# EasyEDA Pro project ProProject_2024电赛清单扩展板_Wang01_2024-08-05.epro

# Schematic Schematic1
Create Date: 2024-07-23; Page Name: P1; Project Name: 2024电赛清单扩展板_Wang01; Schematic Name: Schematic1; Update Date: 2024-07-27; Company: 嘉立创EDA; Page Size: A4; Version: V1.0
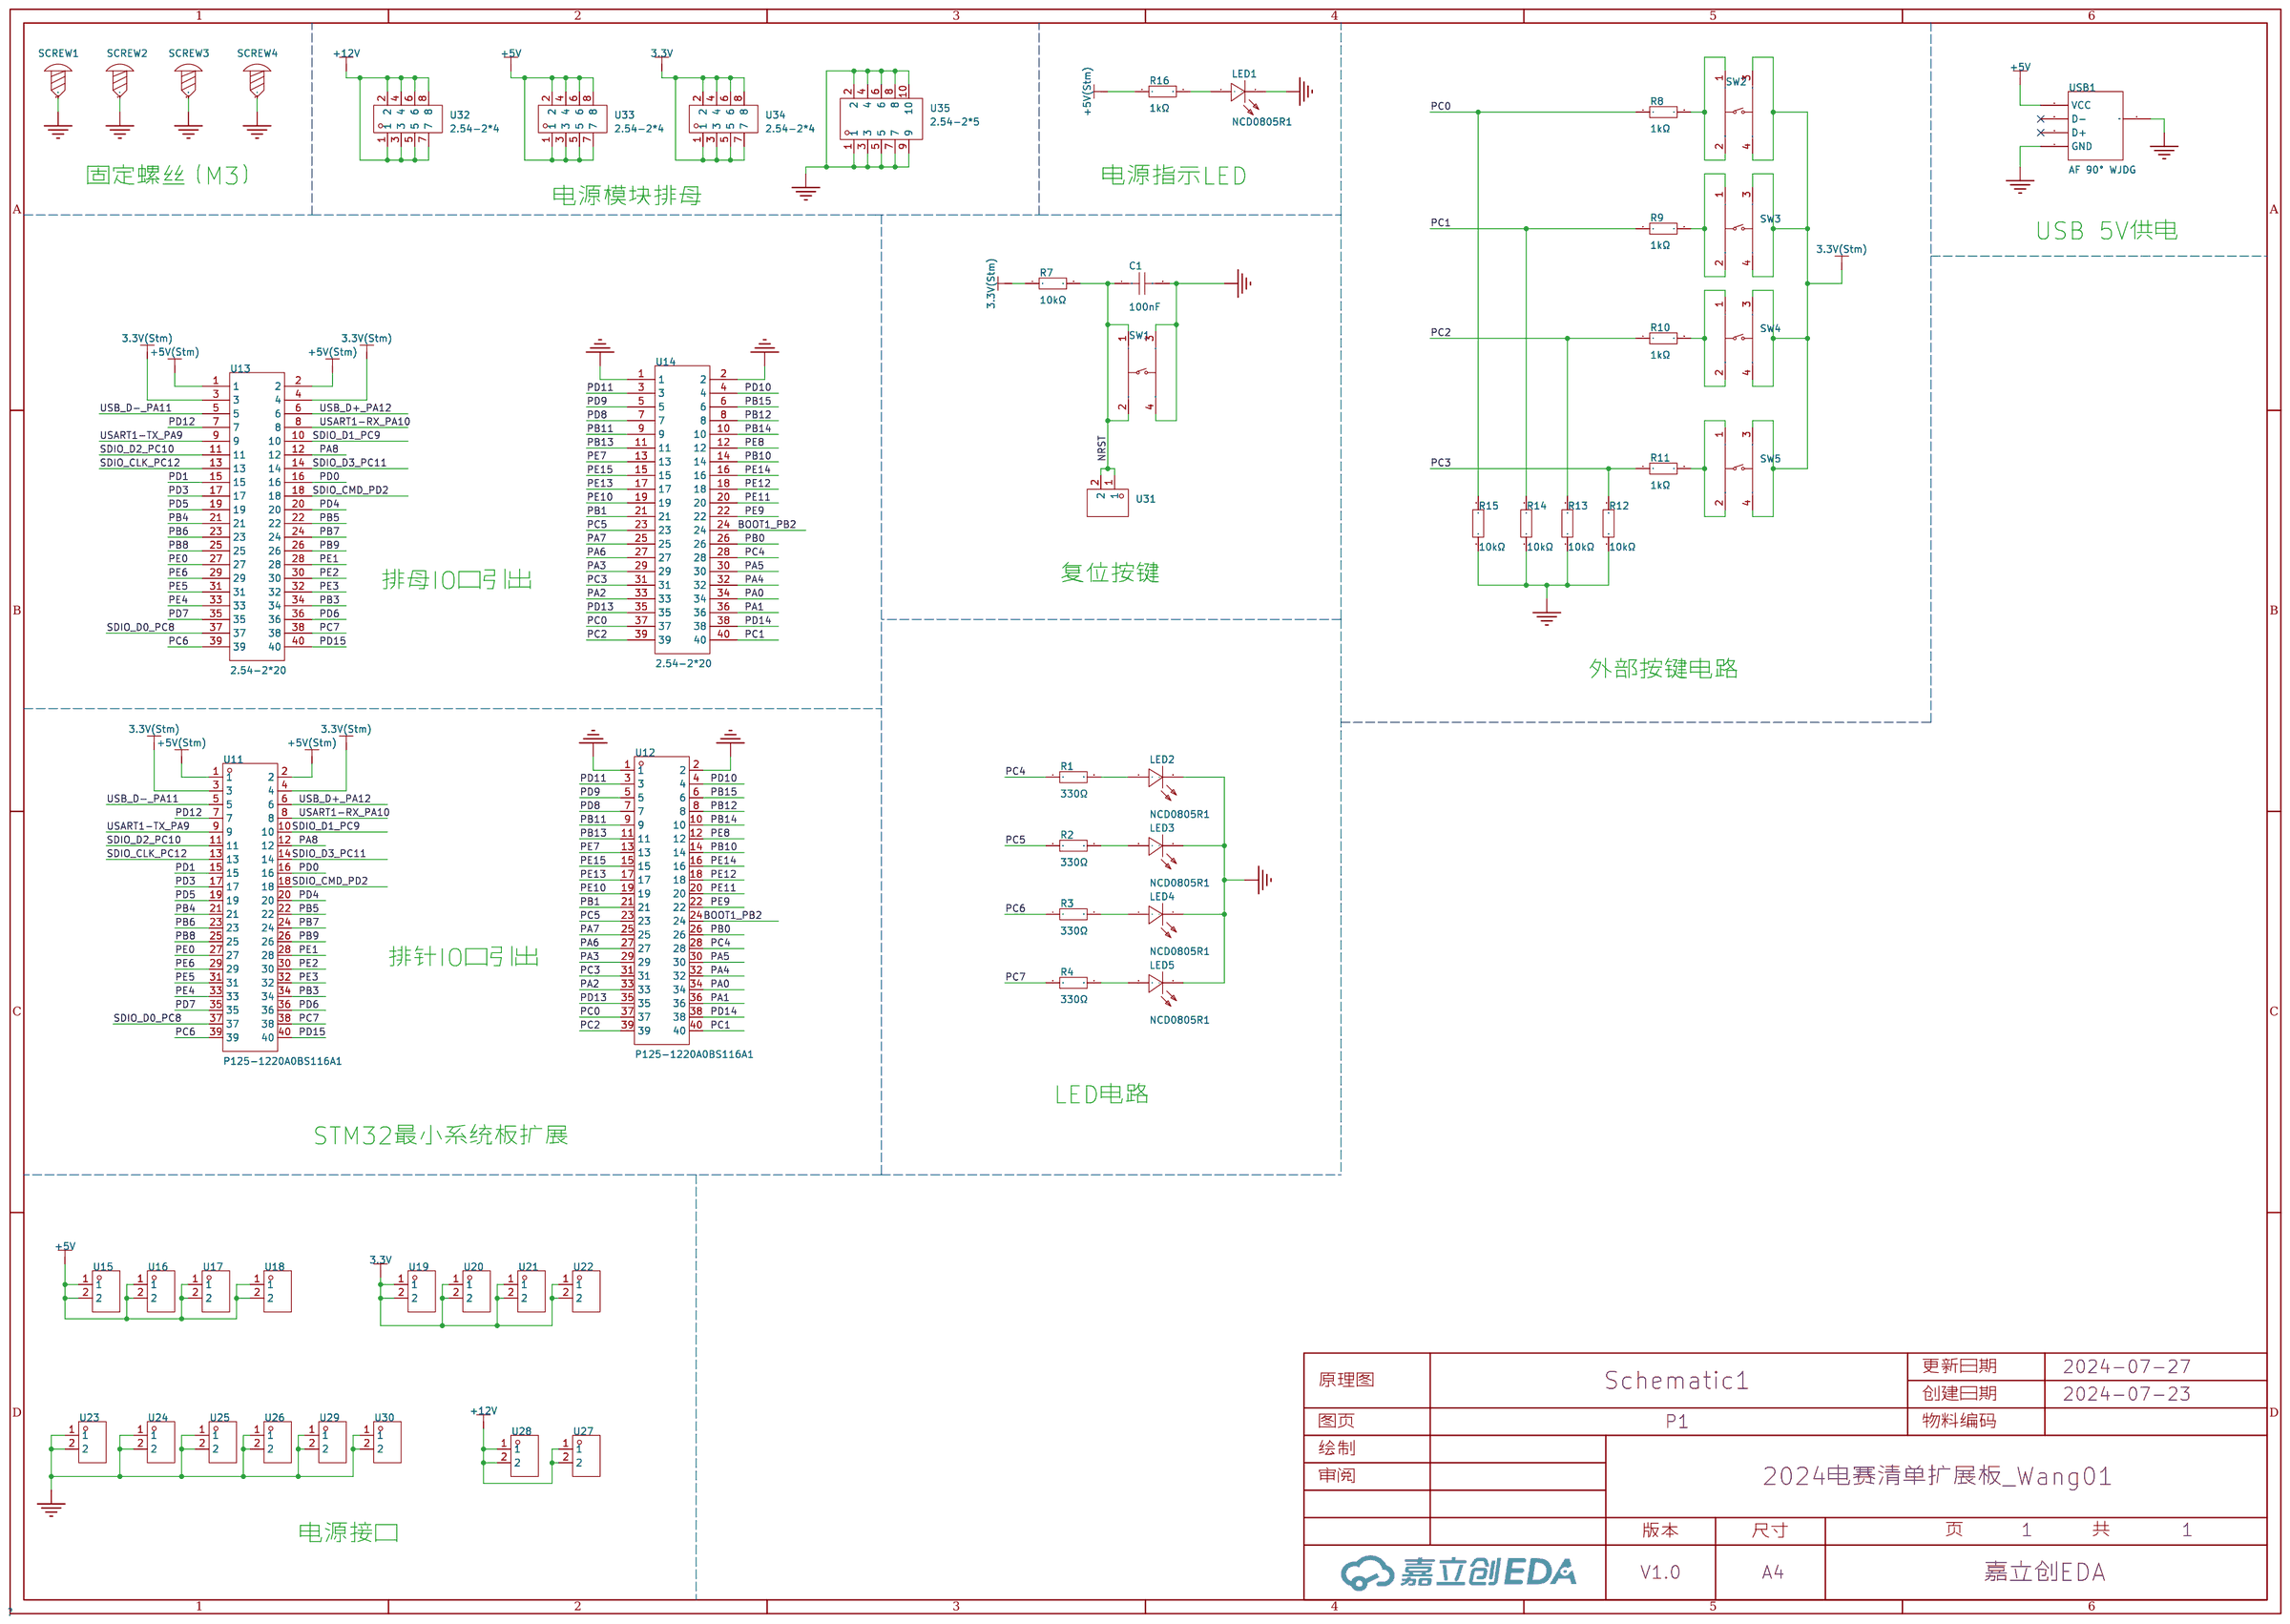
[diagram p0: schematic sheet]

## Parts
C1  100nF  [C0603]
LED1  NCD0805R1  [LED0805-R-RD]
LED2  NCD0805R1  [LED0805-R-RD]
LED3  NCD0805R1  [LED0805-R-RD]
LED4  NCD0805R1  [LED0805-R-RD]
LED5  NCD0805R1  [LED0805-R-RD]
R1  330Ω  [R0805]
R2  330Ω  [R0805]
R3  330Ω  [R0805]
R4  330Ω  [R0805]
R7  10kΩ  [R1206]
R8  1kΩ  [R0805]
R9  1kΩ  [R0805]
R10  1kΩ  [R0805]
R11  1kΩ  [R0805]
R12  10kΩ  [R0805]
R13  10kΩ  [R0805]
R14  10kΩ  [R0805]
R15  10kΩ  [R0805]
R16  1kΩ  [R0603]
SCREW1  -  [M3螺丝]
SCREW2  -  [M3螺丝]
SCREW3  -  [M3螺丝]
SCREW4  -  [M3螺丝]
SW1  TS665CJ  [SW-TH_4P-L6.0-W6.0-P4.50-LS6.5]
SW2  TS665CJ  [SW-TH_4P-L6.0-W6.0-P4.50-LS6.5]
SW3  TS665CJ  [SW-TH_4P-L6.0-W6.0-P4.50-LS6.5]
SW4  TS665CJ  [SW-TH_4P-L6.0-W6.0-P4.50-LS6.5]
SW5  TS665CJ  [SW-TH_4P-L6.0-W6.0-P4.50-LS6.5]
U11  P125-1220A0BS116A1  [HDR-TH_40P-P2.54-V-M-R2-C20-S2.54_10-97-7406]
U12  P125-1220A0BS116A1  [HDR-TH_40P-P2.54-V-M-R2-C20-S2.54_10-97-7406]
U13  2.54-2*20  [HDR-TH_40P-P2.54-V-F-R2-C20-S2.54]
U14  2.54-2*20  [HDR-TH_40P-P2.54-V-F-R2-C20-S2.54]
U15  KF301-5.0-2P  [CONN-TH_P5.00_KF301-5.0-2P]
U16  KF301-5.0-2P  [CONN-TH_P5.00_KF301-5.0-2P]
U17  KF301-5.0-2P  [CONN-TH_P5.00_KF301-5.0-2P]
U18  KF301-5.0-2P  [CONN-TH_P5.00_KF301-5.0-2P]
U19  KF301-5.0-2P  [CONN-TH_P5.00_KF301-5.0-2P]
U20  KF301-5.0-2P  [CONN-TH_P5.00_KF301-5.0-2P]
U21  KF301-5.0-2P  [CONN-TH_P5.00_KF301-5.0-2P]
U22  KF301-5.0-2P  [CONN-TH_P5.00_KF301-5.0-2P]
U23  KF301-5.0-2P  [CONN-TH_P5.00_KF301-5.0-2P]
U24  KF301-5.0-2P  [CONN-TH_P5.00_KF301-5.0-2P]
U25  KF301-5.0-2P  [CONN-TH_P5.00_KF301-5.0-2P]
U26  KF301-5.0-2P  [CONN-TH_P5.00_KF301-5.0-2P]
U27  KF301-5.0-2P  [CONN-TH_P5.00_KF301-5.0-2P]
U28  KF301-5.0-2P  [CONN-TH_P5.00_KF301-5.0-2P]
U29  KF301-5.0-2P  [CONN-TH_P5.00_KF301-5.0-2P]
U30  KF301-5.0-2P  [CONN-TH_P5.00_KF301-5.0-2P]
U31  KF301-5.0-2P  [CONN-TH_P5.00_KF301-5.0-2P]
U32  2.54-2*4  [HDR-TH_8P-P2.54-V-F-R2-C4-S2.54]
U33  2.54-2*4  [HDR-TH_8P-P2.54-V-F-R2-C4-S2.54]
U34  2.54-2*4  [HDR-TH_8P-P2.54-V-F-R2-C4-S2.54]
U35  2.54-2*5  [HDR-TH_10P-P2.54-V-F-R2-C5-S2.54]
USB1  AF 90° WJDG  [USB-A-TH_AF-WJDG]

## Library data of the parts
C1 = CC0603KRX7R9BB104: 容值:100nF;精度:±10%;额定电压:50V;材质(温度系数):X7R;; LCSC Part Name: 100nF ±10% 50V; Supplier Part: C14663; Manufacturer: YAGEO(国巨); Supplier Footprint: 0603; JLCPCB Part Class: 基础库; Datasheet: https://atta.szlcsc.com/upload/public/pdf/source/20180910/C282072_33301C7F631E79921B82A8DAC6BCC5B3.pdf; Supplier: LCSC; Tolerance: ±10%; Voltage Rated: 50V; Temperature Coefficient: X7R
LED1-LED5 = NCD0805R1: 灯头类型:-;发光颜色:红色;正向电压(VF):1.6V~2.6V;功率:65mW;正向电流:20mA;主波长:615nm~630nm;二极管配置:独立二极管;透镜颜色:无色透明透镜;色温:-;发光强度:67mcd~195mcd;发光角度:130°;载带方式:-;工作温度:-30℃~+85℃;; Supplier Part: C84256; Manufacturer: 国星光电; Supplier Footprint: 0805; JLCPCB Part Class: 基础库; Datasheet: https://atta.szlcsc.com/upload/public/pdf/source/20200820/C84256_F0A75A43B3EAD75808600A0514C76B99.pdf; Supplier: LCSC; Emitted Color: 红色; Forward Voltage (VF): 1.6V~2.6V; Power Dissipation: 65mW; Forward Current: 20mA; Dominant Wavelength: 615nm~630nm; Diode Configuration: 独立二极管; Lens Color: 无色透明透镜; Luminous Intensity: 67mcd~195mcd; Viewing Angle: 130°; Operating Temperature: -30℃~+85℃
R1-R4 = 0805W8F3300T5E: 电阻类型:厚膜电阻;阻值:330Ω;精度:±1%;功率:125mW;最大工作电压:150V;温度系数:±100ppm/℃;; LCSC Part Name: 330Ω ±1% 125mW 厚膜电阻; Supplier Part: C17630; Manufacturer: UNI-ROYAL(厚声); Supplier Footprint: 0805; JLCPCB Part Class: 基础库; Datasheet: https://atta.szlcsc.com/upload/public/pdf/source/20200306/C422600_1E6D84923E4A46A82E41ADD87F860B5C.pdf; Supplier: LCSC; Type: 厚膜电阻; Tolerance: ±1%; Power(Watts): 125mW; Overload Voltage (Max): 150V; Temperature Coefficient: ±100ppm/℃; Operating Temperature Range: -55℃~+155℃
R7 = 1206W4F1002T5E: 电阻类型:厚膜电阻;阻值:10kΩ;精度:±1%;功率:250mW;最大工作电压:200V;温度系数:±100ppm/℃;; LCSC Part Name: 10kΩ ±1% 250mW 厚膜电阻; Supplier Part: C17902; Manufacturer: UNI-ROYAL(厚声); Supplier Footprint: 1206; JLCPCB Part Class: 基础库; Datasheet: https://atta.szlcsc.com/upload/public/pdf/source/20200306/C422600_1E6D84923E4A46A82E41ADD87F860B5C.pdf; Supplier: LCSC; Type: 厚膜电阻; Tolerance: ±1%; Power(Watts): 250mW; Overload Voltage (Max): 200V; Temperature Coefficient: ±100ppm/℃; Operating Temperature Range: -55℃~+155℃
R8-R11 = 0805W8F1001T5E: 电阻类型:厚膜电阻;阻值:1kΩ;精度:±1%;功率:125mW;最大工作电压:150V;温度系数:±100ppm/℃;; LCSC Part Name: 1kΩ ±1% 125mW 厚膜电阻; Supplier Part: C17513; Manufacturer: UNI-ROYAL(厚声); Supplier Footprint: 0805; JLCPCB Part Class: 基础库; Datasheet: https://atta.szlcsc.com/upload/public/pdf/source/20200306/C422600_1E6D84923E4A46A82E41ADD87F860B5C.pdf; Supplier: LCSC; Type: 厚膜电阻; Tolerance: ±1%; Power(Watts): 125mW; Overload Voltage (Max): 150V; Temperature Coefficient: ±100ppm/℃; Operating Temperature Range: -55℃~+155℃
R12-R15 = 0805W8F1002T5E_C17414: 电阻类型:厚膜电阻;阻值:10kΩ;精度:±1%;功率:125mW;最大工作电压:150V;温度系数:±100ppm/℃;; LCSC Part Name: 10kΩ ±1% 125mW 厚膜电阻; Supplier Part: C17414; Manufacturer: UNI-ROYAL(厚声); Manufacturer Part: 0805W8F1002T5E; Supplier Footprint: 0805; JLCPCB Part Class: 基础库; Datasheet: https://atta.szlcsc.com/upload/public/pdf/source/20200306/C422600_1E6D84923E4A46A82E41ADD87F860B5C.pdf; Supplier: LCSC; Type: 厚膜电阻; Tolerance: ±1%; Power(Watts): 125mW; Overload Voltage (Max): 150V; Temperature Coefficient: ±100ppm/℃; Operating Temperature Range: -55℃~+155℃
R16 = 0603WAF1001T5E: 电阻类型:厚膜电阻;阻值:1kΩ;精度:±1%;功率:100mW;最大工作电压:75V;温度系数:±100ppm/℃;; LCSC Part Name: 1kΩ ±1% 100mW 厚膜电阻; Supplier Part: C21190; Manufacturer: UNI-ROYAL(厚声); Supplier Footprint: 0603; JLCPCB Part Class: 基础库; Datasheet: https://atta.szlcsc.com/upload/public/pdf/source/20200306/C422600_1E6D84923E4A46A82E41ADD87F860B5C.pdf; Supplier: LCSC; Type: 厚膜电阻; Tolerance: ±1%; Power(Watts): 100mW; Overload Voltage (Max): 75V; Temperature Coefficient: ±100ppm/℃; Operating Temperature Range: -55℃~+155℃
SCREW1-SCREW4 = M3螺丝: Supplier Footprint: 插件
SW1-SW5 = TS665CJ: 电路结构:单刀单掷;按钮形状:圆形按钮;安装方式:直插;开关长度:6mm;开关宽度:6mm;开关高度:5mm;触点电流:50mA;额定电压(DC):12V;带灯:-;机械寿命:-;; LCSC Part Name: 6*6*5mm 直插 轻触开关; Supplier Part: C393938; Manufacturer: SHOU HAN(首韩); Supplier Footprint: 插件; JLCPCB Part Class: 扩展库; Datasheet: https://atta.szlcsc.com/upload/public/pdf/source/20190521/C393938_BDABEAC600B4C55E200A80AA129B70BC.pdf; Supplier: LCSC; Circuit: 单刀单掷; Actuator Style: 圆形按钮; Mounting Style: 直插; Switch Length: 6mm; Switch Width: 6mm; Switch Height: 5mm; Contact Current: 50mA; Voltage Rating (DC): 12V
U11 U12 = P125-1220A0BS116A1: 插针结构:2x20P;间距:2.54mm;行距:2.54mm;圆针/方针:方针;安装类型:直插;排数:双排;总PIN位数:40P;配合针长度:6mm;塑高:2.5mm;端接针长度:3mm;触头材质:黄铜;触头镀层:金;工作温度范围:-40℃~+105℃;颜色:黑色;; LCSC Part Name: 2x20P 间距:2.54mm 方针 直插; Supplier Part: C19190512; Manufacturer: Yxcon(宇熙精密); Supplier Footprint: 插件,P=2.54mm; JLCPCB Part Class: 扩展库; Datasheet: https://atta.szlcsc.com/upload/public/pdf/source/20231110/933F8D648B10E9101EFC894132A28518.pdf; Supplier: LCSC; Pin Structure: 2x20P; Pitch: 2.54mm; Row Spacing: 2.54mm; Circluar Pins/Square Pins: 方针; Mounting Type: 直插; Number of Rows: 双排; Number of Pins: 40P; Length of Mating Pin: 6mm; Insulation Height: 2.5mm; Length of End Connection Pin: 3mm; Contact Material: 黄铜; Contact Plating: 金; Operating Temperature Range: -40℃~+105℃; Color: 黑色
U13 U14 = 2.54-2*20: 插孔结构:2x20P;间距:2.54mm;行距:2.54mm;圆孔/方孔:方孔;安装类型:直插;排数:双排;总孔位数:40P;额定电流:2.5A;额定电压:-;插孔方向:顶部;塑高:8.5mm;工作温度范围:-40℃~+105℃;; LCSC Part Name: 间距:2.54mm 2x20P 直插; Supplier Part: C2977589; Manufacturer: ZHOURI(洲日); Supplier Footprint: 插件,P=2.54mm; JLCPCB Part Class: 扩展库; Datasheet: https://atta.szlcsc.com/upload/public/pdf/source/20220328/834E302BE3C038BBC5C70F5E02589B1E.pdf; Supplier: LCSC; Holes Structure: 2x20P; Pitch: 2.54mm; Row Spacing: 2.54mm; Circular Hole / Square Hole: 方孔; Mounting Type: 直插; Number of Rows: 双排; Number of Holes: 40P; Current Rating (Max): 2.5A; Holes Direction: 顶部; Insulation Height: 8.5mm; Operating Temperature Range: -40℃~+105℃
U15-U31 = KF301-5.0-2P: 结构:1x2P;间距:5mm;颜色:蓝色;安装方式:直插;额定电流:17A;额定电压:250V;排数:1;线规 - AWG:14~22;线规 - 平方毫米:1.5;每排PIN数:2;工作温度范围:-30℃~+120℃;; LCSC Part Name: 5mm 1x2P 排数:1 每排P数:2 直插; Supplier Part: C474881; Manufacturer: KEFA(科发); Supplier Footprint: 插件,P=5mm; JLCPCB Part Class: 扩展库; Datasheet: https://atta.szlcsc.com/upload/public/pdf/source/20230317/03A5B5FC229D6F9225E8F51DA1A4E80A.pdf; Supplier: LCSC; Structure: 1x2P; Pitch: 5mm; Color: 蓝色; Mounting Style: 直插; Current Rating (Max): 17A; Voltage Rating (Max): 250V; Number of Pins: 2P; Number of Rows: 1; Wire Gauge - AWG: 14~22; Wire Gauge - mm2: 1.5; Number of PINs Per Row: 2; Operating Temperature Range: -30℃~+120℃
U32-U34 = 2.54-2*4: 插孔结构:2x4P;间距:2.54mm;行距:2.54mm;圆孔/方孔:方孔;安装类型:直插;排数:双排;总孔位数:8P;额定电流:2.5A;额定电压:-;插孔方向:顶部;塑高:8.5mm;工作温度范围:-40℃~+105℃;; LCSC Part Name: 间距:2.54mm 2x4P 直插; Supplier Part: C2977588; Manufacturer: ZHOURI(洲日); Supplier Footprint: 插件,P=2.54mm; JLCPCB Part Class: 扩展库; Datasheet: https://atta.szlcsc.com/upload/public/pdf/source/20220328/363EB391BC0EB759CF231FC910753CBE.pdf; Supplier: LCSC; Holes Structure: 2x4P; Pitch: 2.54mm; Row Spacing: 2.54mm; Circular Hole / Square Hole: 方孔; Mounting Type: 直插; Number of Rows: 双排; Number of Holes: 8P; Current Rating (Max): 2.5A; Holes Direction: 顶部; Insulation Height: 8.5mm; Operating Temperature Range: -40℃~+105℃
U35 = 2.54-2*5: 插孔结构:2x5P;间距:2.54mm;行距:2.54mm;圆孔/方孔:方孔;安装类型:直插;排数:双排;总孔位数:10P;额定电流:2.5A;额定电压:-;插孔方向:顶部;塑高:8.5mm;工作温度范围:-40℃~+105℃;; LCSC Part Name: 间距:2.54mm 2x5P 直插; Supplier Part: C2977587; Manufacturer: ZHOURI(洲日); Supplier Footprint: 插件,P=2.54mm; JLCPCB Part Class: 扩展库; Datasheet: https://atta.szlcsc.com/upload/public/pdf/source/20220328/53961E697C4FF664B69BABFADEC8B830.pdf; Supplier: LCSC; Holes Structure: 2x5P; Pitch: 2.54mm; Row Spacing: 2.54mm; Circular Hole / Square Hole: 方孔; Mounting Type: 直插; Number of Rows: 双排; Number of Holes: 10P; Current Rating (Max): 2.5A; Holes Direction: 顶部; Insulation Height: 8.5mm; Operating Temperature Range: -40℃~+105℃
USB1 = AF 90° WJDG: 连接器类型:Type-A;标准:USB 2.0;公母:母;端口数量:1;触点数量:4P;安装方式:弯插;额定电流 - 电源:1.5A;工作温度范围:-25℃~+85℃;; LCSC Part Name: Type-A 母 弯插; Supplier Part: C456018; Manufacturer: SHOU HAN(首韩); Supplier Footprint: 插件; JLCPCB Part Class: 扩展库; Datasheet: https://atta.szlcsc.com/upload/public/pdf/source/20191113/C456018_B104E062BEB8E11E57E63560E04EE13A.pdf; Supplier: LCSC; Connector Type: Type-A; Standard: USB 2.0; Gender: 母; Number of Ports: 1; Number of Contacts: 4P; Mounting Style: 弯插; Current Rating - Power (Max): 1.5A; Operating Temperature Range: -25℃~+85℃

## Nets
3.3V: U19.1 U19.2 U20.1 U20.2 U21.1 U21.2 U22.1 U22.2 U34.1 U34.2 U34.3 U34.4 U34.5 U34.6 U34.7 U34.8
3.3V(Stm): R7.1 SW2.3(C) SW2.4(D) SW3.3(C) SW3.4(D) SW4.3(C) SW4.4(D) SW5.3(C) SW5.4(D) U11.3 U11.4 U13.3 U13.4
+5V: U15.1 U15.2 U16.1 U16.2 U17.1 U17.2 U18.1 U18.2 U33.1 U33.2 U33.3 U33.4 U33.5 U33.6 U33.7 U33.8 USB1.1(VCC)
+5V(Stm): R16.1 U11.1 U11.2 U13.1 U13.2
+12V: U27.1 U27.2 U28.1 U28.2 U32.1 U32.2 U32.3 U32.4 U32.5 U32.6 U32.7 U32.8
GND: C1.2 LED1.2(-) LED2.2(-) LED3.2(-) LED4.2(-) LED5.2(-) R12.1 R13.1 R14.1 R15.1 SCREW1.1 SCREW2.1 SCREW3.1 SCREW4.1 SW1.3(C) SW1.4(D) U12.1 U12.2 U14.1 U14.2 U23.1 U23.2 U24.1 U24.2 U25.1 U25.2 U26.1 U26.2 U29.1 U29.2 U30.1 U30.2 U35.1 U35.2 U35.3 U35.4 U35.5 U35.6 U35.7 U35.8 U35.9 U35.10 USB1.4(GND) USB1.5(SHLD)
BOOT1_PB2: U12.24 U14.24
NRST: C1.1 R7.2 SW1.1(A) SW1.2(B) U31.1 U31.2
PA0: U12.34 U14.34
PA1: U12.36 U14.36
PA2: U12.33 U14.33
PA3: U12.29 U14.29
PA4: U12.32 U14.32
PA5: U12.30 U14.30
PA6: U12.27 U14.27
PA7: U12.25 U14.25
PA8: U11.12 U13.12
PB0: U12.26 U14.26
PB1: U12.21 U14.21
PB3: U11.34 U13.34
PB4: U11.21 U13.21
PB5: U11.22 U13.22
PB6: U11.23 U13.23
PB7: U11.24 U13.24
PB8: U11.25 U13.25
PB9: U11.26 U13.26
PB10: U12.14 U14.14
PB11: U12.9 U14.9
PB12: U12.8 U14.8
PB13: U12.11 U14.11
PB14: U12.10 U14.10
PB15: U12.6 U14.6
PC0: R8.1 R15.2 U12.37 U14.37
PC1: R9.1 R14.2 U12.40 U14.40
PC2: R10.1 R13.2 U12.39 U14.39
PC3: R11.1 R12.2 U12.31 U14.31
PC4: R1.1 U12.28 U14.28
PC5: R2.1 U12.23 U14.23
PC6: R3.1 U11.39 U13.39
PC7: R4.1 U11.38 U13.38
PD0: U11.16 U13.16
PD1: U11.15 U13.15
PD3: U11.17 U13.17
PD4: U11.20 U13.20
PD5: U11.19 U13.19
PD6: U11.36 U13.36
PD7: U11.35 U13.35
PD8: U12.7 U14.7
PD9: U12.5 U14.5
PD10: U12.4 U14.4
PD11: U12.3 U14.3
PD12: U11.7 U13.7
PD13: U12.35 U14.35
PD14: U12.38 U14.38
PD15: U11.40 U13.40
PE0: U11.27 U13.27
PE1: U11.28 U13.28
PE2: U11.30 U13.30
PE3: U11.32 U13.32
PE4: U11.33 U13.33
PE5: U11.31 U13.31
PE6: U11.29 U13.29
PE7: U12.13 U14.13
PE8: U12.12 U14.12
PE9: U12.22 U14.22
PE10: U12.19 U14.19
PE11: U12.20 U14.20
PE12: U12.18 U14.18
PE13: U12.17 U14.17
PE14: U12.16 U14.16
PE15: U12.15 U14.15
SDIO_CLK_PC12: U11.13 U13.13
SDIO_CMD_PD2: U11.18 U13.18
SDIO_D0_PC8: U11.37 U13.37
SDIO_D1_PC9: U11.10 U13.10
SDIO_D2_PC10: U11.11 U13.11
SDIO_D3_PC11: U11.14 U13.14
USART1-RX_PA10: U11.8 U13.8
USART1-TX_PA9: U11.9 U13.9
USB_D+_PA12: U11.6 U13.6
USB_D-_PA11: U11.5 U13.5
$LED2_1: LED2.1(+) R1.2
$LED3_1: LED3.1(+) R2.2
$LED4_1: LED4.1(+) R3.2
$LED5_1: LED5.1(+) R4.2
Net-(LED1-1): LED1.1(+) R16.2
Net-(R8-2): R8.2 SW2.1(A) SW2.2(B)
Net-(R9-2): R9.2 SW3.1(A) SW3.2(B)
Net-(R10-2): R10.2 SW4.1(A) SW4.2(B)
Net-(R11-2): R11.2 SW5.1(A) SW5.2(B)

Not connected (* = marked no-connect by the designer): USB1 2(D-)* 3(D+)*

## Notes on the sheet
- 固定螺丝（M3）
- 电源指示LED
- 电源模块排母
- USB 5V供电
- 排母IO口引出
- 复位按键
- 外部按键电路
- 排针IO口引出
- LED电路
- STM32最小系统板扩展
- 电源接口

# Board PCB1
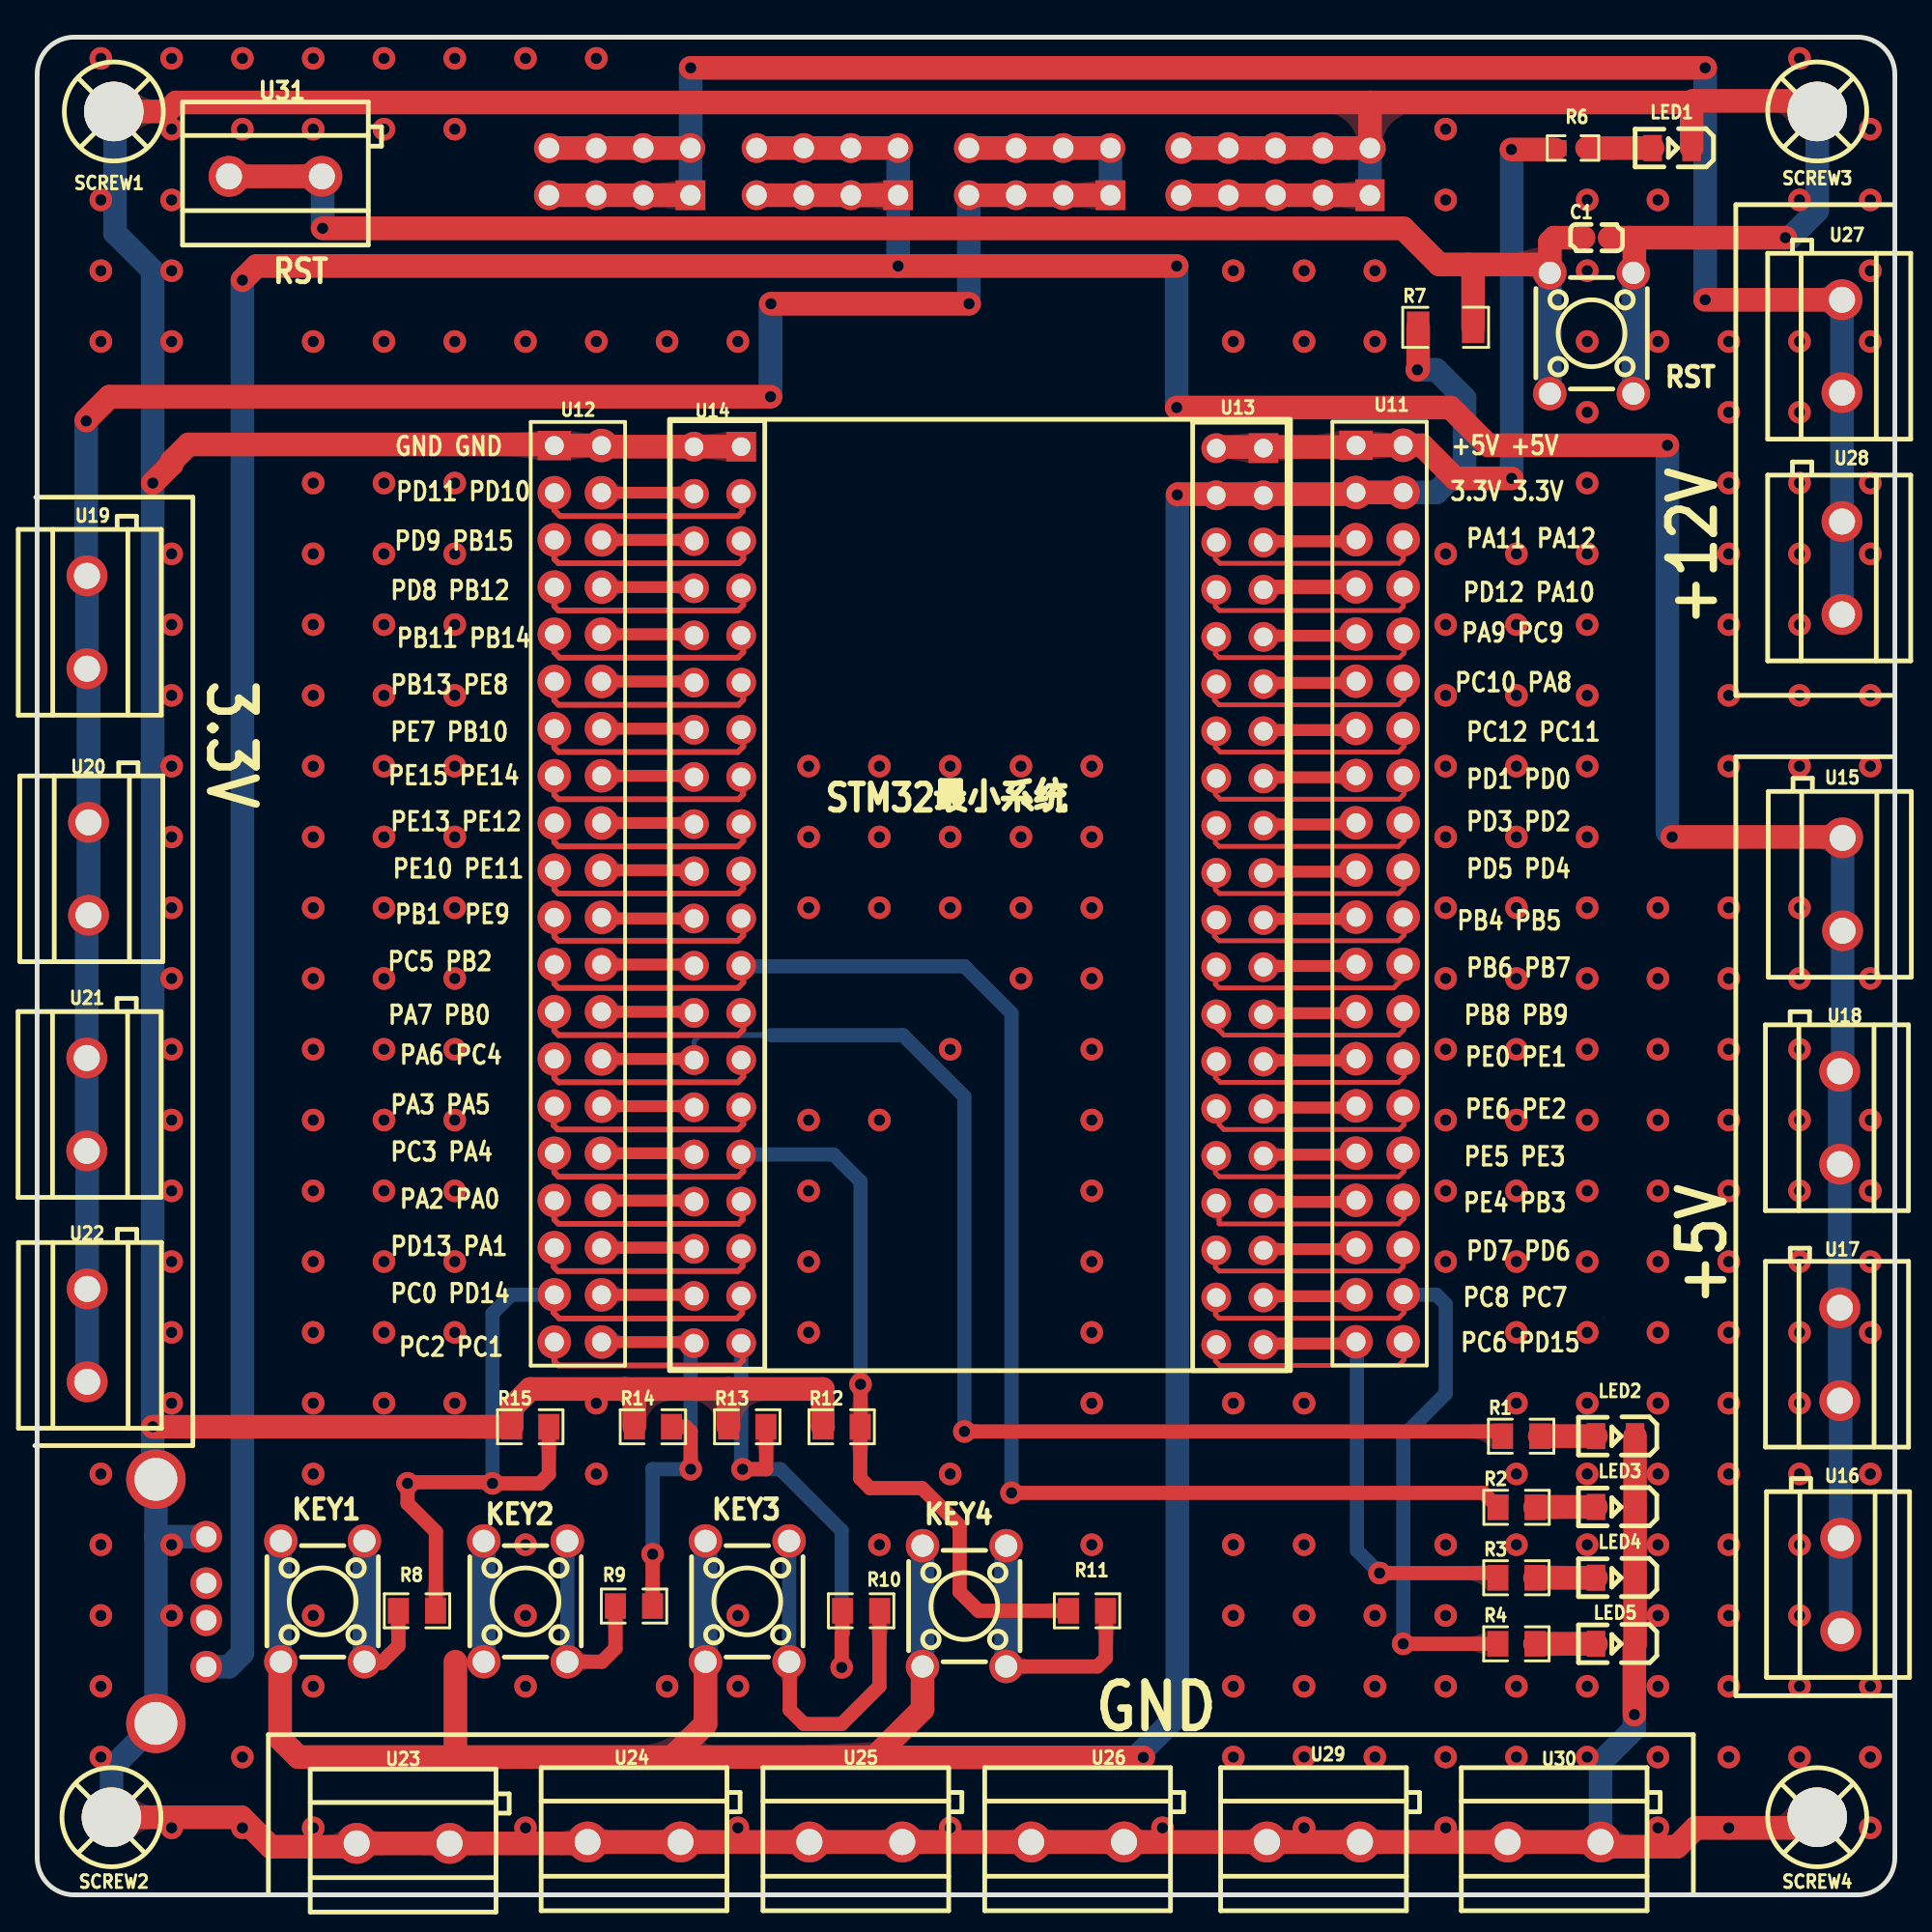
[diagram p1: board, top side]
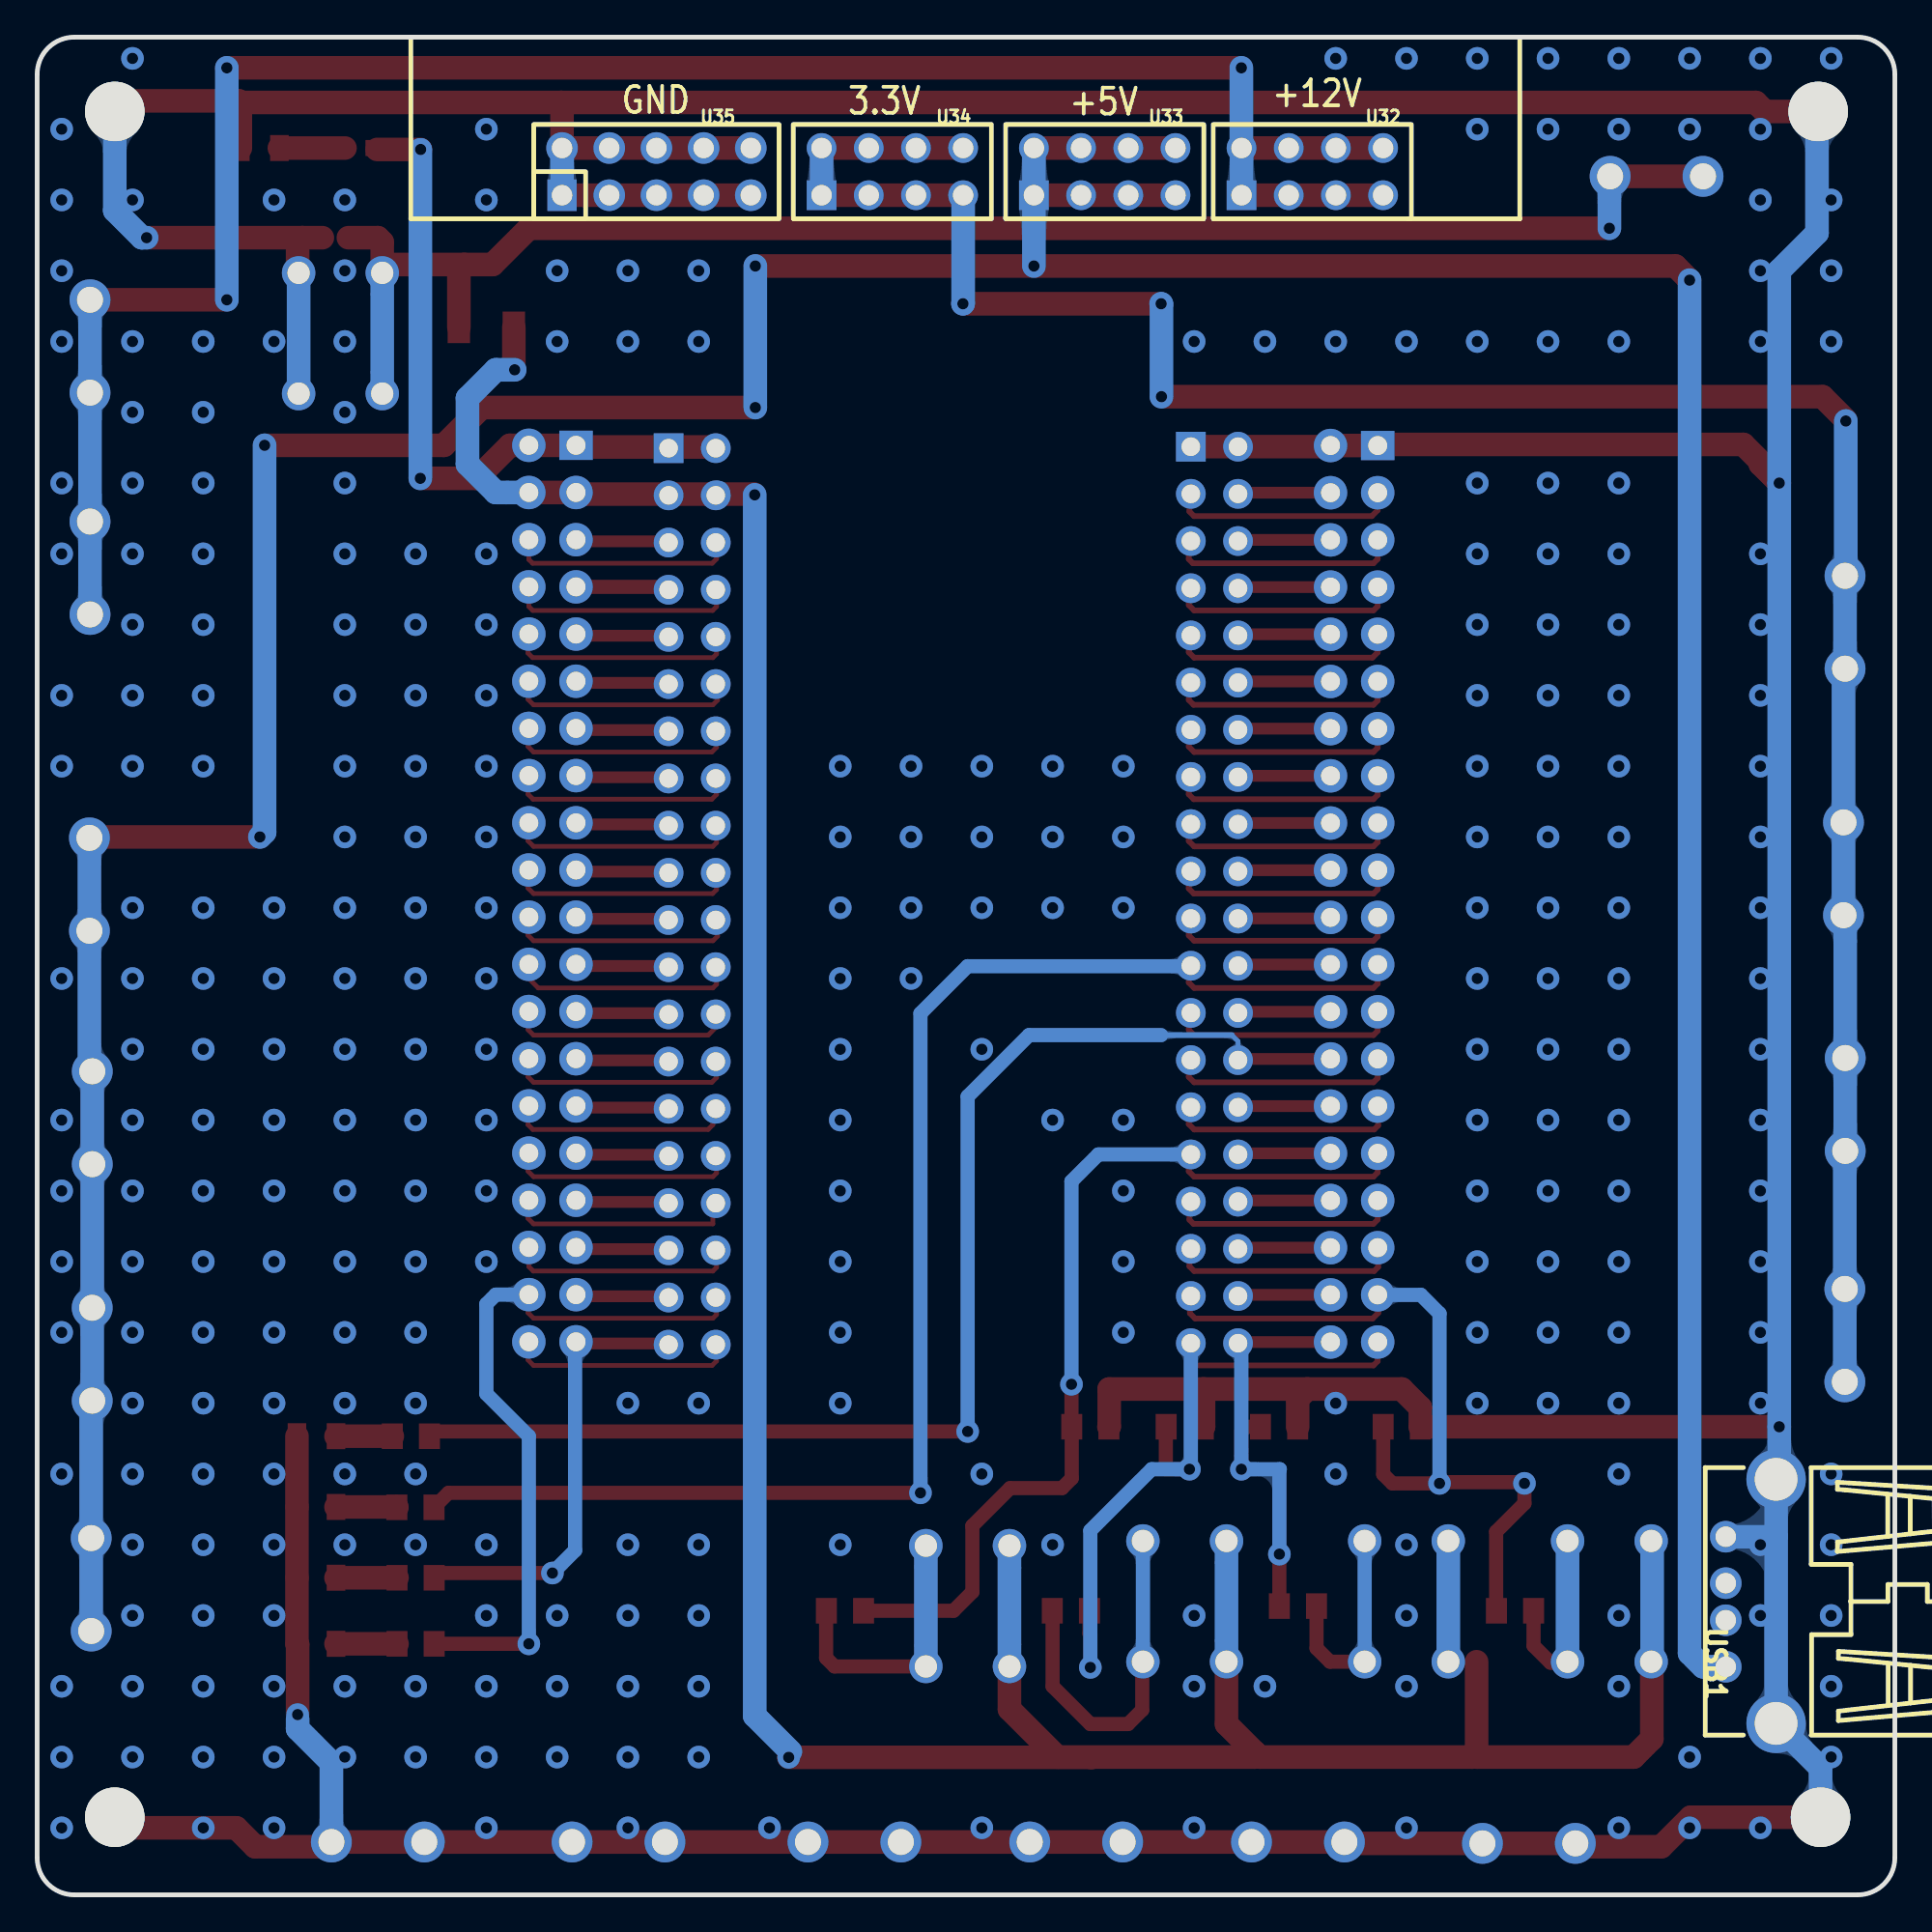
[diagram p2: board, bottom side, seen from below]

Outline 100 x 100 mm; copper layers: Top Layer, Bottom Layer. Coordinates in mm from the lower left corner of the outline.
Outline path: 0,98 0,2 arc(0.59,0.59) 2,0 98,0 arc(99.41,0.59) 100,2 100,98 arc(99.41,99.41) 98,100 2,100 arc(0.59,99.41) 0,98
Stack: Top Layer 0.035mm / Dielectric1 1.51mm FR4 er 4.5 / Bottom Layer 0.035mm

## Design rules (mm)
template: 自定义配置
spacing copperThickness1oz (default): track to track 0.102, other pairs 0.152 to 0.3
spacing copperThickness2oz: track to track 0.203, other pairs 0.152 to 0.3
track width copperThickness1oz (default): min 0.254, default 0.762, max 2.54
track width copperThickness2oz: min 0.203, default 0.254, max 2.54
track width 12V: min 0.762, default 1.27, max 2.54
track width 5V: min 0.762, default 1.27, max 2.54
track width 3.3V: min 0.762, default 1.27, max 2.54
track width GND: min 0.762, default 1.27, max 2.54
differential pair differentialPair (default): width min 0.127, default 0.254, max 2.54; gap min 0.152, default 0.152
via viaSize: diameter min 0.5, default 0.61, max 10; hole min 0.3, default 0.305, max 6.299
via BIG (default): diameter min 1.219, default 1.524, max 10; hole min 0.61, default 0.762, max 6.299
net 3.3V uses 3.3V
net +5V uses 5V
net GND uses GND
net +12V uses 12V

## Placement (name value [footprint] x y rotation side)
C1  100nF  [C0603]  83.95 89.2 0 top
KEY1  TS665CJ  [sw-th_4p-l6.0-w6.0-p4.50-ls6.5#2]  15.37 15.8 270 top
KEY2  TS665CJ  [sw-th_4p-l6.0-w6.0-p4.50-ls6.5#2]  26.29 15.8 270 top
KEY3  TS665CJ  [sw-th_4p-l6.0-w6.0-p4.50-ls6.5#2]  38.23 15.8 270 top
KEY4  TS665CJ  [SW-TH_4P-L6.0-W6.0-P4.50-LS6.5]  49.91 15.55 270 top
LED1  NCD0805R1  [LED0805-R-RD]  88.01 94.03 180 top
LED2  NCD0805R1  [LED0805-R-RD]  84.96 24.69 180 top
LED3  NCD0805R1  [LED0805-R-RD]  84.96 20.88 180 top
LED4  NCD0805R1  [LED0805-R-RD]  84.96 17.07 180 top
LED5  NCD0805R1  [LED0805-R-RD]  84.96 13.51 180 top
R1  330Ω  [R0805]  79.88 24.69 0 top
R2  330Ω  [R0805]  79.64 20.86 0 top
R3  330Ω  [R0805]  79.63 17.07 0 top
R4  330Ω  [R0805]  79.63 13.51 0 top
R6  510Ω  [R0603]  82.68 94.03 0 top
R7  10kΩ  [R1206]  75.82 84.38 0 top
R8  1kΩ  [R0805]  20.45 15.29 180 top
R9  1kΩ  [R0805]  32.13 15.55 180 top
R10  1kΩ  [R0805]  44.35 15.29 0 top
R11  1kΩ  [R0805]  56.51 15.29 0 top
R12  10kΩ  [R0805]  43.31 25.2 0 top
R13  10kΩ  [R0805]  38.23 25.2 0 top
R14  10kΩ  [R0805]  33.15 25.2 0 top
R15  10kΩ  [R0805]  26.54 25.2 0 top
RST  TS665CJ  [sw-th_4p-l6.0-w6.0-p4.50-ls6.5]  83.67 84.06 90 top
SCREW1  -  [M3螺丝]  4.19 95.94 0 top
SCREW2  -  [M3螺丝]  4.06 4.12 0 top
SCREW3  -  [M3螺丝]  95.88 95.94 0 top
SCREW4  -  [M3螺丝]  95.88 4.12 0 top
U11  P125-1220A0BS116A1  [hdr-th_40p-p2.54-v-m-r2-c20-s2.54_10-97-7406]  72.26 53.9 270 top
U12  P125-1220A0BS116A1  [hdr-th_40p-p2.54-v-m-r2-c20-s2.54_10-97-7406]  29.11 53.89 270 top
U13  2.54-2*20  [hdr-th_40p-p2.54-v-f-r2-c20-s2.54]  64.74 53.75 90 top
U14  2.54-2*20  [hdr-th_40p-p2.54-v-f-r2-c20-s2.54]  36.63 53.83 90 top
U15  KF301-5.0-2P  [conn-th_p5.00_kf301-5.0-2p#2]  97.19 54.4 90 top
U16  KF301-5.0-2P  [conn-th_p5.00_kf301-5.0-2p#2]  97.09 16.7 90 top
U17  KF301-5.0-2P  [conn-th_p5.00_kf301-5.0-2p#2]  97.04 29.1 90 top
U18  KF301-5.0-2P  [conn-th_p5.00_kf301-5.0-2p#2]  97.03 41.83 90 top
U19  KF301-5.0-2P  [conn-th_p5.00_kf301-5.0-2p]  2.68 68.5 270 top
U20  KF301-5.0-2P  [conn-th_p5.00_kf301-5.0-2p]  2.77 55.23 270 top
U21  KF301-5.0-2P  [conn-th_p5.00_kf301-5.0-2p]  2.67 42.55 270 top
U22  KF301-5.0-2P  [conn-th_p5.00_kf301-5.0-2p]  2.69 30.12 270 top
U23  KF301-5.0-2P  [CONN-TH_P5.00_KF301-5.0-2P]  19.7 2.77 0 top
U24  KF301-5.0-2P  [CONN-TH_P5.00_KF301-5.0-2P]  32.13 2.84 0 top
U25  KF301-5.0-2P  [CONN-TH_P5.00_KF301-5.0-2P]  44.07 2.84 0 top
U26  KF301-5.0-2P  [CONN-TH_P5.00_KF301-5.0-2P]  56.01 2.84 0 top
U27  KF301-5.0-2P  [conn-th_p5.00_kf301-5.0-2p#2]  97.16 83.36 90 top
U28  KF301-5.0-2P  [conn-th_p5.00_kf301-5.0-2p#2]  97.16 71.42 90 top
U29  KF301-5.0-2P  [CONN-TH_P5.00_KF301-5.0-2P]  68.71 2.84 0 top
U30  KF301-5.0-2P  [CONN-TH_P5.00_KF301-5.0-2P]  81.66 2.84 0 top
U31  KF301-5.0-2P  [CONN-TH_P5.00_KF301-5.0-2P]  12.83 92.51 0 top
U32  2.54-2*4  [HDR-TH_8P-P2.54-V-F-R2-C4-S2.54]  31.36 92.76 180 bottom
U33  2.54-2*4  [HDR-TH_8P-P2.54-V-F-R2-C4-S2.54]  42.53 92.76 180 bottom
U34  2.54-2*4  [HDR-TH_8P-P2.54-V-F-R2-C4-S2.54]  53.96 92.76 180 bottom
U35  2.54-2*5  [HDR-TH_10P-P2.54-V-F-R2-C5-S2.54]  66.66 92.76 180 bottom
USB1  AF 90° WJDG  [USB-A-TH_AF-WJDG]  7.75 15.8 90 bottom

## Footprints (pads in the part's own frame, mm; a bottom-side part is the same pattern mirrored in y, then rotated)
C0603
  rect 0.8x0.9 smd: 1(-0.7,0) 2(0.7,0)
CONN-TH_P5.00_KF301-5.0-2P
  round 2.2 hole 1.4: 1(-2.5,0) 2(2.5,0)
conn-th_p5.00_kf301-5.0-2p
  round 2.2 hole 1.4: 1(2.5,0) 2(-2.5,0)
conn-th_p5.00_kf301-5.0-2p#2
  round 2.2 hole 1.4: 1(-2.5,0) 2(2.5,0)
HDR-TH_8P-P2.54-V-F-R2-C4-S2.54
  rect 1.6x1.6 hole 1.1: 1(-3.81,-1.27)
  round 1.6 hole 1.1: 2(-3.81,1.27) 3(-1.27,-1.27) 4(-1.27,1.27) 5(1.27,-1.27) 6(1.27,1.27) 7(3.81,-1.27) 8(3.81,1.27)
HDR-TH_10P-P2.54-V-F-R2-C5-S2.54
  rect 1.575x1.7 hole 1.1: 1(-5.08,-1.27)
  round 1.7 hole 1.1: 2(-5.08,1.27) 3(-2.54,-1.27) 4(-2.54,1.27) 5(0,-1.27) 6(0,1.27) 7(2.54,-1.27) 8(2.54,1.27) 9(5.08,-1.27) 10(5.08,1.27)
hdr-th_40p-p2.54-v-f-r2-c20-s2.54
  rect 1.6x1.6 hole 1: 1(24.13,-1.27)
  round 1.6 hole 1: 2(24.13,1.27) 3(21.59,-1.27) 4(21.59,1.27) 5(19.05,-1.27) 6(19.05,1.27) 7(16.51,-1.27) 8(16.51,1.27) 9(13.97,-1.27) 10(13.97,1.27) 11(11.43,-1.27) 12(11.43,1.27) 13(8.89,-1.27) 14(8.89,1.27) 15(6.35,-1.27) 16(6.35,1.27) 17(3.81,-1.27) 18(3.81,1.27) 19(1.27,-1.27) 20(1.27,1.27) 21(-1.27,-1.27) 22(-1.27,1.27) 23(-3.81,-1.27) 24(-3.81,1.27) 25(-6.35,-1.27) 26(-6.35,1.27) 27(-8.89,-1.27) 28(-8.89,1.27) 29(-11.43,-1.27) 30(-11.43,1.27) 31(-13.97,-1.27) 32(-13.97,1.27) 33(-16.51,-1.27) 34(-16.51,1.27) 35(-19.05,-1.27) 36(-19.05,1.27) 37(-21.59,-1.27) 38(-21.59,1.27) 39(-24.13,-1.27) 40(-24.13,1.27)
hdr-th_40p-p2.54-v-m-r2-c20-s2.54_10-97-7406
  rect 1.575x1.8 hole 1.02: 1(-24.13,-1.27)
  round 1.8 hole 1.02: 2(-24.13,1.27) 3(-21.59,-1.27) 4(-21.59,1.27) 5(-19.05,-1.27) 6(-19.05,1.27) 7(-16.51,-1.27) 8(-16.51,1.27) 9(-13.97,-1.27) 10(-13.97,1.27) 11(-11.43,-1.27) 12(-11.43,1.27) 13(-8.89,-1.27) 14(-8.89,1.27) 15(-6.35,-1.27) 16(-6.35,1.27) 17(-3.81,-1.27) 18(-3.81,1.27) 19(-1.27,-1.27) 20(-1.27,1.27) 21(1.27,-1.27) 22(1.27,1.27) 23(3.81,-1.27) 24(3.81,1.27) 25(6.35,-1.27) 26(6.35,1.27) 27(8.89,-1.27) 28(8.89,1.27) 29(11.43,-1.27) 30(11.43,1.27) 31(13.97,-1.27) 32(13.97,1.27) 33(16.51,-1.27) 34(16.51,1.27) 35(19.05,-1.27) 36(19.05,1.27) 37(21.59,-1.27) 38(21.59,1.27) 39(24.13,-1.27) 40(24.13,1.27)
LED0805-R-RD
  rect 1x1.399 smd: 1(1.05,0) 2(-1.05,0)
M3螺丝
  round 3.2 hole 3.2: 1(-0.064,0.064)
R0603
  rect 0.806x0.864 smd: 1(-0.753,0) 2(0.753,0)
R0805
  rect 1.133x1.377 smd: 1(-1,0) 2(1,0)
R1206
  rect 1.208x1.701 smd: 1(-1.479,0) 2(1.479,0)
sw-th_4p-l6.0-w6.0-p4.50-ls6.5
  round 1.8 hole 1.2: 1(3.25,2.25) 2(-3.25,2.25) 3(3.25,-2.25) 4(-3.25,-2.25)
SW-TH_4P-L6.0-W6.0-P4.50-LS6.5
  round 1.8 hole 1.2: 1(-3.25,2.25) 2(3.25,2.25) 3(-3.25,-2.25) 4(3.25,-2.25)
sw-th_4p-l6.0-w6.0-p4.50-ls6.5#2
  round 1.8 hole 1.2: 1(-3.25,2.25) 2(3.25,2.25) 3(-3.25,-2.25) 4(3.25,-2.25)
USB-A-TH_AF-WJDG
  round 1.7 hole 1.1: 1(-3.521,1.355) 2(-1.018,1.355) 3(0.981,1.355) 4(3.48,1.355)
  round 3.2 hole 2.3: 5(-6.57,-1.355) 5(6.57,-1.355)

## Nets
As in the schematic, except:
3.3V(STM): KEY1.3 KEY1.4 KEY2.3 KEY2.4 KEY3.3 KEY3.4 KEY4.3 KEY4.4 R7.1 U11.3 U11.4 U13.3 U13.4
+5V(STM): R6.1 U11.1 U11.2 U13.1 U13.2
GND: C1.2 LED1.2 LED2.2 LED3.2 LED4.2 LED5.2 R12.1 R13.1 R14.1 R15.1 RST.3 RST.4 SCREW1.1 SCREW2.1 SCREW3.1 SCREW4.1 U12.1 U12.2 U14.1 U14.2 U23.1 U23.2 U24.1 U24.2 U25.1 U25.2 U26.1 U26.2 U29.1 U29.2 U30.1 U30.2 U35.1 U35.2 U35.3 U35.4 U35.5 U35.6 U35.7 U35.8 U35.9 U35.10 USB1.4 USB1.5
$LED1_1: LED1.1 R6.2
$R8_2: KEY1.1 KEY1.2 R8.2
$R9_2: KEY2.1 KEY2.2 R9.2
$R10_2: KEY3.1 KEY3.2 R10.2
$R11_2: KEY4.1 KEY4.2 R11.2
NRST: C1.1 R7.2 RST.1 RST.2 U31.1 U31.2

Pads without a net: USB1 2 3

## Via types
v1: diameter 1.219, hole 0.61, Top Layer to Bottom Layer, 326 vias

## Routing (per net, layer and track width the routed paths; a pad name or vN(x,y) marks a point on that pad's centre or on a via; arc(x,y) is an arc through that point)
3.3V: length 128.5
  Top Layer w1.27: U34.2 U34.4 U34.6 U34.8 ; 57.77,91.49 50.15,91.49 ; v1(39.48,80.65) 3.9,80.65 2.65,79.4 ; 2.77,70.92 U19.2 ; v1(50.16,85.65) v1(39.5,85.65)
  Bottom Layer w1.27: v1(2.64,79.34) 2.64,71.11 2.67,71.08 ; v1(39.48,80.65) 39.48,85.63 v1(39.5,85.65) ; U19.2 U19.1 2.77,65.92 U20.2 U20.1 2.67,52.64 U21.2 U21.1 2.69,40.02 U22.2 U22.1 ; v1(50.16,85.65) 50.15,85.66 50.15,91.49 ; 57.77,91.49 U34.2
3.3V(STM): length 189.6
  Top Layer w1.27: KEY3.4 35.98,9.19 34.45,7.67 ; 22.52,7.63 22.52,12.55 ; 22.52,7.63 22.73,7.42 34.2,7.42 34.45,7.67 ; 22.52,7.63 22.52,7.42 14.06,7.42 13.08,8.4 13.08,12.55 ; 74.34,84.38 74.34,82.14 v1(74.29,82.09) ; 34.45,7.67 34.45,7.42 45.09,7.42 47.66,9.99 KEY4.4 ; 61.39,75.37 61.41,75.4 70.95,75.4 71.03,75.49 73.57,75.49 ; 43.25,7.39 43.26,7.4 v1(59.54,7.4)
  Bottom Layer w1.27: KEY3.4 KEY3.3 ; v1(74.29,82.09) 75.31,82.09 76.84,80.57 76.84,77.01 75.31,75.49 73.57,75.49 ; KEY2.4 KEY2.3 ; 63.34,75.49 63.43,75.4 ; KEY4.4 KEY4.3 ; v1(61.37,75.36) 61.37,9.64 59.45,7.72 ; 13.07,19.05 13.07,13.01 13.12,12.96 KEY1.4
+5V: length 256.4
  Top Layer w1.27: v1(61.34,87.68) v1(46.34,87.68) 11.81,87.68 v1(11.05,86.92) ; v1(87.76,78.03) 78.1,78.03 76.07,80.06 v1(61.34,80.06) ; U33.2 U33.4 U33.6 U33.8 ; v1(88.01,56.95) 97.14,56.95 U15.2 ; 46.34,91.49 38.72,91.49
  Bottom Layer w1.27: v1(61.34,87.68) v1(61.34,80.06) ; v1(88.01,56.95) 87.76,57.2 v1(87.76,78.03) ; v1(11.05,86.92) 11.05,13 10.32,12.28 USB1.1 ; v1(46.34,87.68) U33.2 ; U15.2 U15.1 97.19,44.49 U18.2 U18.1 97.03,31.61 U17.2 U17.1 97.09,26.55 U16.2 U16.1
+5V(STM): length 36.7
  Top Layer w1.27: v1(79.38,76.25) 76.33,76.25 74.55,78.03 71.03,78.03 70.95,77.94 63.43,77.94 ; v1(79.36,93.95) 81.7,93.95
  Bottom Layer w1.27: v1(79.38,76.25) 79.38,93.93
+12V: length 113.5
  Top Layer w1.27: 27.55,91.49 35.17,91.49 ; U27.2 v1(89.79,85.86) ; U32.2 U32.4 U32.6 U32.8 ; v1(89.79,98.35) v1(35.18,98.35)
  Bottom Layer w1.27: U27.2 U27.1 U28.2 U28.1 ; v1(89.79,98.35) v1(89.79,85.86) ; v1(35.18,98.35) 35.18,94.04 U32.2 35.17,91.49
GND: length 434.4
  Top Layer w1.27: 31.62,27.23 26.54,27.23 25.54,26.23 R15.1 v1(6.22,25.2) ; 31.62,27.23 32.15,26.71 R14.1 ; 31.62,27.23 37.21,27.23 ; 71.78,96.49 7.48,96.49 7,96 SCREW1.1 ; 71.78,96.49 89.06,96.49 ; 71.78,96.49 71.74,96.45 U35.2 U35.4 U35.6 U35.8 U35.10 ; 71.74,91.49 61.58,91.49 ; LED1.2 89.06,96.49 ; 89.06,96.49 89.15,96.57 95.25,96.57 SCREW3.1 ; 85.72,89.2 85.98,88.95 85.98,87.37 RST.3 ; 85.72,89.2 C1.2 ; 85.72,89.2 v1(94.11,89.2) ; R13.1 37.21,25.21 37.21,27.23 ; 38.01,77.96 30.44,77.96 30.38,78.02 U12.1 ; SCREW4.1 95.25,3.61 v1(91.06,3.61) 89.28,3.61 88.26,2.59 84.41,2.59 U30.2 U30.1 U29.2 U29.1 U26.2 U26.1 U25.2 U25.1 U24.2 U24.1 29.56,2.77 U23.2 U23.1 17.02,2.59 12.57,2.59 10.99,4.18 SCREW2.1 ; 37.21,27.23 42.29,27.23 42.29,25.21 R12.1 ; v1(6.22,76) 7.24,77.01 7.24,77.16 8.16,78.08 27.85,78.08 ; v1(85.98,9.7) 85.98,13.48 LED5.2 LED4.2 LED3.2 LED2.2
  Bottom Layer w1.27: U30.2 84.16,7.12 85.98,8.94 85.98,9.45 ; SCREW1.1 4.19,95.94 4.19,89.46 6.22,87.43 v1(6.22,76) v1(6.22,25.2) 6.22,22.54 USB1.5 6.39,19.28 ; 71.74,91.49 U35.2 ; v1(94.11,89.2) 94.36,89.2 95.82,90.67 SCREW3.1 ; SCREW2.1 4,6.84 USB1.5 6.39,19.28 ; USB1.4 6.39,19.28 ; RST.3 RST.4
  vias: v1(3.43,98.86) v1(3.43,91.24) v1(3.43,87.43) v1(3.43,83.62) v1(3.43,22.66) v1(3.43,18.85) v1(3.43,15.04) v1(3.43,11.23) v1(3.43,7.42) v1(7.24,98.86) v1(7.24,95.05) v1(7.24,91.24) v1(7.24,87.43) v1(7.24,83.62) v1(7.24,72.19) v1(7.24,68.38) v1(7.24,64.57) v1(7.24,60.76) v1(7.24,56.95) v1(7.24,53.14) v1(7.24,49.33) v1(7.24,45.52) v1(7.24,41.71) v1(7.24,37.9) v1(7.24,34.09) v1(7.24,30.28) v1(7.24,26.47) v1(7.24,18.85) v1(7.24,15.04) v1(7.24,3.61) v1(11.05,98.86) v1(11.05,95.05) v1(11.05,7.42) v1(11.05,3.61) v1(14.86,98.86) v1(14.86,95.05) v1(14.86,83.62) v1(14.86,76) v1(14.86,72.19) v1(14.86,68.38) v1(14.86,64.57) v1(14.86,60.76) v1(14.86,56.95) v1(14.86,53.14) v1(14.86,49.33) v1(14.86,45.52) v1(14.86,41.71) v1(14.86,37.9) v1(14.86,34.09) v1(14.86,30.28) v1(14.86,26.47) v1(14.86,22.66) v1(14.86,15.04) v1(14.86,11.23) v1(14.86,3.61) v1(18.67,98.86) v1(18.67,95.05) v1(18.67,83.62) v1(18.67,76) v1(18.67,72.19) v1(18.67,68.38) v1(18.67,64.57) v1(18.67,60.76) v1(18.67,56.95) v1(18.67,53.14) v1(18.67,49.33) v1(18.67,45.52) v1(18.67,41.71) v1(18.67,37.9) v1(18.67,34.09) v1(18.67,30.28) v1(18.67,26.47) v1(22.48,98.86) v1(22.48,95.05) v1(22.48,83.62) v1(22.48,76) v1(22.48,72.19) v1(22.48,68.38) v1(22.48,64.57) v1(22.48,60.76) v1(22.48,56.95) v1(22.48,53.14) v1(22.48,49.33) v1(22.48,45.52) v1(22.48,41.71) v1(22.48,37.9) v1(22.48,34.09) v1(22.48,30.28) v1(22.48,26.47) v1(26.29,98.86) v1(26.29,83.62) v1(26.29,18.85) v1(26.29,15.04) v1(26.29,11.23) v1(26.29,3.61) v1(30.1,98.86) v1(30.1,83.62) v1(30.1,26.47) v1(30.1,22.66) v1(33.91,83.62) v1(33.91,11.23) v1(37.72,83.62) v1(37.72,15.04) v1(37.72,11.23) v1(37.72,3.61) v1(41.53,60.76) v1(41.53,56.95) v1(41.53,53.14) v1(41.53,41.71) v1(41.53,37.9) v1(41.53,34.09) v1(41.53,30.28) v1(45.34,60.76) v1(45.34,56.95) v1(45.34,53.14) v1(45.34,41.71) v1(45.34,18.85) v1(49.15,60.76) v1(49.15,56.95) v1(49.15,53.14) v1(49.15,45.52) v1(49.15,22.66) v1(49.15,3.61) v1(52.96,60.76) v1(52.96,56.95) v1(52.96,53.14) v1(52.96,49.33) v1(56.77,60.76) v1(56.77,56.95) v1(56.77,53.14) v1(56.77,49.33) v1(56.77,45.52) v1(56.77,41.71) v1(56.77,37.9) v1(56.77,34.09) v1(56.77,30.28) v1(56.77,26.47) v1(56.77,18.85) v1(60.58,3.61) v1(64.39,87.43) v1(64.39,83.62) v1(64.39,26.47) v1(64.39,18.85) v1(64.39,15.04) v1(64.39,11.23) v1(64.39,7.42) v1(68.2,87.43) v1(68.2,83.62) v1(68.2,26.47) v1(68.2,18.85) v1(68.2,15.04) v1(68.2,11.23) v1(68.2,7.42) v1(68.2,3.61) v1(72.01,87.43) v1(72.01,83.62) v1(72.01,15.04) v1(72.01,11.23) v1(72.01,7.42) v1(75.82,95.05) v1(75.82,91.24) v1(75.82,72.19) v1(75.82,68.38) v1(75.82,64.57) v1(75.82,60.76) v1(75.82,56.95) v1(75.82,53.14) v1(75.82,49.33) v1(75.82,45.52) v1(75.82,41.71) v1(75.82,37.9) v1(75.82,34.09) v1(75.82,18.85) v1(75.82,15.04) v1(75.82,11.23) v1(75.82,7.42) v1(75.82,3.61) v1(79.63,72.19) v1(79.63,68.38) v1(79.63,64.57) v1(79.63,60.76) v1(79.63,56.95) v1(79.63,53.14) v1(79.63,49.33) v1(79.63,45.52) v1(79.63,41.71) v1(79.63,37.9) v1(79.63,34.09) v1(79.63,30.28) v1(79.63,26.47) v1(79.63,22.66) v1(79.63,18.85) v1(79.63,11.23) v1(79.63,7.42) v1(83.44,91.24) v1(83.44,87.43) v1(83.44,83.62) v1(83.44,79.81) v1(83.44,76) v1(83.44,72.19) v1(83.44,68.38) v1(83.44,64.57) v1(83.44,60.76) v1(83.44,56.95) v1(83.44,53.14) v1(83.44,49.33) v1(83.44,45.52) v1(83.44,41.71) v1(83.44,37.9) v1(83.44,34.09) v1(83.44,30.28) v1(83.44,26.47) v1(83.44,22.66) v1(83.44,18.85) v1(83.44,11.23) v1(83.44,7.42) v1(87.25,91.24) v1(87.25,83.62) v1(87.25,53.14) v1(87.25,49.33) v1(87.25,45.52) v1(87.25,41.71) v1(87.25,37.9) v1(87.25,34.09) v1(87.25,30.28) v1(87.25,26.47) v1(87.25,22.66) v1(87.25,18.85) v1(87.25,15.04) v1(87.25,11.23) v1(87.25,7.42) v1(87.25,3.61) v1(91.06,83.62) v1(91.06,79.81) v1(91.06,76) v1(91.06,72.19) v1(91.06,68.38) v1(91.06,64.57) v1(91.06,60.76) v1(91.06,53.14) v1(91.06,49.33) v1(91.06,45.52) v1(91.06,41.71) v1(91.06,37.9) v1(91.06,34.09) v1(91.06,30.28) v1(91.06,26.47) v1(91.06,22.66) v1(91.06,18.85) v1(91.06,15.04) v1(91.06,11.23) v1(91.06,7.42) v1(94.87,98.86) v1(94.87,91.24) v1(94.87,83.62) v1(94.87,79.81) v1(94.87,76) v1(94.87,72.19) v1(94.87,68.38) v1(94.87,64.57) v1(94.87,60.76) v1(94.87,53.14) v1(94.87,49.33) v1(94.87,45.52) v1(94.87,41.71) v1(94.87,37.9) v1(94.87,34.09) v1(94.87,30.28) v1(94.87,26.47) v1(94.87,22.66) v1(94.87,18.85) v1(94.87,15.04) v1(94.87,11.23) v1(94.87,7.42) v1(98.68,95.05) v1(98.68,91.24) v1(98.68,87.43) v1(98.68,83.62) v1(98.68,76) v1(98.68,72.19) v1(98.68,64.57) v1(98.68,60.76) v1(98.68,49.33) v1(98.68,41.71) v1(98.68,37.9) v1(98.68,34.09) v1(98.68,30.28) v1(98.68,22.66) v1(98.68,11.23) v1(98.68,7.42) v1(98.68,3.61)
$LED1_1: length 3.5
  Top Layer w1.27: LED1.1 R6.2
$LED2_1: length 3
  Top Layer w1.27: LED2.1 R1.2
$LED3_1: length 3.3
  Top Layer w1.27: R2.2 80.65,20.88 LED3.1
$LED4_1: length 3.3
  Top Layer w1.27: LED4.1 R3.2
$LED5_1: length 3.3
  Top Layer w1.27: LED5.1 R4.2
$R8_2: length 11.6
  Top Layer w0.762: R8.2 19.45,13.41 18.54,12.5 17.16,12.5 ; 17.16,12.5 17.21,12.55 KEY1.2 ; 17.16,12.5 17.11,12.55
  Bottom Layer w1.27: KEY1.1 KEY1.2
$R9_2: length 11.7
  Top Layer w0.762: KEY2.2 30.41,12.55 31.13,13.28 R9.2
  Bottom Layer w0.762: KEY2.1 KEY2.2
$R10_2: length 19.4
  Top Layer w0.762: 40.51,12.77 40.51,9.96 41.28,9.19 43.31,9.19 45.34,11.23 45.34,15.28 R10.2
  Bottom Layer w0.762: KEY3.1 KEY3.2
$R11_2: length 14.6
  Top Layer w0.762: KEY4.2 57.07,12.3 57.53,12.75 57.53,15.28 R11.2
  Bottom Layer w1.27: KEY4.1 KEY4.2
BOOT1_PB2: length 5.1
  Top Layer w0.635: 35.47,50.02 35.41,50.08 30.38,50.08
NRST: length 88.4
  Top Layer w1.27: 77.01,87.76 75.49,87.76 73.53,89.71 v1(15.37,89.71) ; 77.01,87.76 80.98,87.76 RST.1 81.42,88.97 81.66,89.2 C1.1 ; 77.01,87.76 77.3,87.47 R7.2 ; U31.1 U31.2
  Bottom Layer w1.27: RST.2 RST.1 ; v1(15.37,89.71) 15.37,92.47 U31.2
PA0: length 5.1
  Top Layer w0.635: 35.47,37.32 35.41,37.38 30.38,37.38
PA1: length 5.1
  Top Layer w0.635: 30.38,34.84 35.41,34.84 35.47,34.78
PA2: length 12.3
  Top Layer w0.305: 38.01,37.32 37.97,37.28 37.97,36.34 37.75,36.12 28.07,36.12 27.84,36.35 U12.33
PA3: length 12.4
  Top Layer w0.305: U12.29 27.81,42.43 27.81,41.41 28.03,41.2 37.72,41.2 38.01,41.49 38.01,42.4
PA4: length 5.1
  Top Layer w0.635: 30.38,39.92 35.41,39.92 35.47,39.86
PA5: length 5.1
  Top Layer w0.635: 35.47,42.4 35.41,42.46 30.38,42.46
PA6: length 12.3
  Top Layer w0.305: 38.01,44.94 38.01,44.03 37.72,43.74 28.07,43.74 27.84,43.97 U12.27
PA7: length 12.3
  Top Layer w0.305: 38.01,47.48 38.01,46.57 37.72,46.28 28.07,46.28 27.84,46.51 U12.25
PA8: length 12.4
  Top Layer w0.254: 63.43,65.24 63.37,65.19 63.37,64.31 63.63,64.06 73.28,64.06 73.57,64.36 73.57,65.33
PB0: length 5.1
  Top Layer w0.635: 30.38,47.54 35.41,47.54 35.47,47.48
PB1: length 12.3
  Top Layer w0.305: 38.01,52.56 38.01,51.65 37.72,51.36 28.07,51.36 27.84,51.59 U12.21
PB3: length 12.3
  Top Layer w0.254: 73.57,37.39 73.57,36.42 73.28,36.12 63.63,36.12 63.63,37.1 63.43,37.3
PB4: length 5.1
  Top Layer w0.635: 65.97,52.54 70.95,52.54 71.03,52.63
PB5: length 12.4
  Top Layer w0.254: 63.43,52.54 63.37,52.48 63.37,51.61 63.62,51.36 73.28,51.36 73.57,51.66 73.57,52.63
PB6: length 5.1
  Top Layer w0.635: 71.03,50.09 70.95,50 65.97,50
PB7: length 12.2
  Top Layer w0.254: 73.57,50.09 73.57,49.37 73.03,48.82 63.63,48.82 63.43,49.02 63.43,50
PB8: length 5.1
  Top Layer w0.635: 65.97,47.46 70.95,47.46 71.03,47.55
PB9: length 12.2
  Top Layer w0.254: 63.43,47.46 63.43,46.73 63.88,46.28 73.28,46.28 73.57,46.58 73.57,47.55
PB10: length 5.1
  Top Layer w0.635: 35.47,62.72 35.41,62.78 30.38,62.78
PB11: length 12.3
  Top Layer w0.305: 38.01,67.8 38.01,66.89 37.72,66.6 28.12,66.6 27.84,66.88 U12.9
PB12: length 5.1
  Top Layer w0.635: 30.38,70.4 35.41,70.4 35.47,70.34
PB13: length 12.3
  Top Layer w0.305: U12.11 27.84,64.29 28.07,64.06 37.75,64.06 38.01,64.32 38.01,65.26
PB14: length 5.1
  Top Layer w0.635: 35.47,67.8 35.41,67.86 30.38,67.86
PB15: length 5.1
  Top Layer w0.635: 30.38,72.94 35.41,72.94 35.47,72.88
PC0: length 43.1
  Top Layer w0.305: 27.81,32.29 27.81,31.33 28.11,31.02 37.66,31.02 37.95,31.31 37.95,32.25
  Top Layer w0.762: R15.2 27.54,22.64 27.05,22.15 v1(24.51,22.15) 24.44,22.22 20.01,22.22 v1(19.94,22.15) 19.94,21.07 21.46,19.55 21.46,15.31 R8.1
  Bottom Layer w0.762: v1(24.51,22.15) 24.51,31.29 25.51,32.3 U12.37
PC1: length 24.6
  Top Layer w0.635: 35.47,29.7 35.41,29.76 30.38,29.76
  Top Layer w0.762: R9.1 v1(33.13,18.34) ; R14.2 34.92,25.2 35.18,24.94 v1(35.18,22.91)
  Bottom Layer w0.762: v1(33.13,18.34) 33.13,22.89 33.11,22.91 v1(35.18,22.91) 35.18,29.52 U14.40
PC2: length 39.8
  Top Layer w0.305: U12.39 27.84,28.73 28.07,28.5 37.72,28.5 38.01,28.79 38.01,29.7
  Top Layer w0.762: v1(37.97,22.91) 39.24,22.91 39.24,25.18 R13.2 ; v1(43.31,12.24) 43.31,14.02 43.35,14.07 R10.1
  Bottom Layer w0.762: v1(43.31,12.24) 43.31,19.61 40,22.91 v1(37.97,22.91) 37.9,22.99 U14.39
PC3: length 51.6
  Top Layer w0.305: U12.31 27.84,38.89 28.07,38.66 37.72,38.66 38.01,38.95 38.01,39.86
  Top Layer w0.762: v1(44.32,27.48) 44.32,25.21 R12.2 44.31,22.42 44.83,21.9 47.62,21.9 49.66,19.86 49.66,16.31 50.67,15.29 R11.1
  Bottom Layer w0.762: v1(44.32,27.48) 44.32,38.41 42.87,39.86 U14.31
PC4: length 69.3
  Top Layer w0.635: 30.38,45 35.41,45 35.47,44.94
  Top Layer w0.762: R1.1 78.63,24.94 v1(49.91,24.94)
  Bottom Layer w0.254: 35.69,46.28 35.36,45.95 U14.28
  Bottom Layer w0.305: 35.69,46.28 39.5,46.28
  Bottom Layer w0.762: v1(49.91,24.94) 49.91,42.98 46.61,46.28 39.5,46.28
PC5: length 80.3
  Top Layer w0.305: 38.01,50.02 38.01,49.11 37.72,48.82 28.07,48.82 27.84,49.05 U12.23
  Top Layer w0.762: v1(52.45,21.64) 77.86,21.64 R2.1
  Bottom Layer w0.762: 37.84,50 37.85,49.99 49.91,49.99 52.45,47.45 v1(52.45,21.64)
PC6: length 24.4
  Top Layer w0.635: 71.03,29.77 70.95,29.68 65.97,29.68
  Top Layer w0.762: v1(72.26,17.32) 78.38,17.32 R3.1
  Bottom Layer w0.762: 71.04,29.69 71.04,18.54 v1(72.26,17.32)
PC7: length 39.1
  Top Layer w0.254: 73.57,32.31 73.57,31.34 73.28,31.04 63.63,31.04 63.43,31.24 63.43,32.22
  Top Layer w0.762: v1(73.53,13.51) R4.1
  Bottom Layer w0.762: 73.58,32.23 73.67,32.31 75.31,32.31 75.82,31.8 75.82,26.98 73.53,24.69 v1(73.53,13.51)
PD0: length 12.3
  Top Layer w0.254: 63.43,60.16 63.43,59.23 63.68,58.98 73.3,58.98 73.57,59.25 73.57,60.25
PD1: length 5.1
  Top Layer w0.635: 65.97,60.16 70.95,60.16 71.03,60.25
PD3: length 5.1
  Top Layer w0.635: 65.97,57.62 70.95,57.62 71.03,57.71
PD4: length 12.3
  Top Layer w0.254: 63.43,55.08 63.43,54.11 63.64,53.9 73.28,53.9 73.57,54.2 73.57,55.17
PD5: length 5.1
  Top Layer w0.635: 65.97,55.08 70.95,55.08 71.03,55.17
PD6: length 12.3
  Top Layer w0.254: 73.57,34.85 73.53,34.81 73.53,33.82 73.29,33.58 63.63,33.58 63.43,33.78 63.43,34.76
PD7: length 5.1
  Top Layer w0.635: 65.97,34.76 70.95,34.76 71.03,34.85
PD8: length 12.3
  Top Layer w0.305: 38.01,70.34 38.01,69.43 37.72,69.14 28.07,69.14 27.84,69.37 U12.7
PD9: length 12.4
  Top Layer w0.305: 38.01,72.88 38.01,71.9 37.79,71.68 28.07,71.68 27.84,71.91 U12.5
PD10: length 5.1
  Top Layer w0.635: 30.38,75.48 35.41,75.48 35.47,75.42
PD11: length 12.3
  Top Layer w0.305: 38.01,75.42 37.97,75.38 37.97,74.47 37.73,74.22 28.15,74.22 27.84,74.53 U12.3
PD12: length 5
  Top Layer w0.762: U11.7 66.16,70.41 66.01,70.26
PD13: length 12.4
  Top Layer w0.305: U12.35 27.81,34.81 27.81,33.79 28.03,33.58 37.72,33.58 37.97,33.83 37.97,34.74 38.01,34.78
PD14: length 5.1
  Top Layer w0.635: 30.38,32.3 35.41,32.3 35.47,32.24
PD15: length 12.3
  Top Layer w0.254: 63.43,29.68 63.43,28.74 63.67,28.5 73.28,28.5 73.57,28.8 73.57,29.77
PE0: length 5.1
  Top Layer w0.635: 71.03,45.01 70.95,44.92 65.97,44.92
PE1: length 12.3
  Top Layer w0.254: 73.57,45.01 73.57,44.03 73.28,43.74 63.68,43.74 63.43,43.99 63.43,44.92
PE2: length 12.2
  Top Layer w0.254: 63.43,42.38 63.63,42.18 63.63,41.45 63.88,41.2 73.32,41.2 73.57,41.46 73.57,42.47
PE3: length 12.3
  Top Layer w0.254: 63.43,39.84 63.43,38.86 63.63,38.66 73.28,38.66 73.57,38.95 73.57,39.93
PE4: length 5.1
  Top Layer w0.635: 65.97,37.3 70.95,37.3 71.03,37.39
PE5: length 5.1
  Top Layer w0.635: 65.97,39.84 70.95,39.84 71.03,39.93
PE6: length 5.1
  Top Layer w0.635: 65.97,42.38 70.95,42.38 71.03,42.47
PE7: length 12.3
  Top Layer w0.305: U12.13 27.84,61.75 28.07,61.52 37.72,61.52 38.01,61.81 38.01,62.72
PE8: length 5.1
  Top Layer w0.635: 30.38,65.32 35.41,65.32 35.47,65.26
PE9: length 5
  Top Layer w0.635: 30.44,52.56 35.47,52.56
PE10: length 12.3
  Top Layer w0.305: U12.19 27.84,54.12 28.06,53.9 37.74,53.9 38.01,54.17 38.01,55.1
PE11: length 5.1
  Top Layer w0.635: 30.38,55.16 35.41,55.16 35.47,55.1
PE12: length 5.1
  Top Layer w0.635: 30.38,57.7 35.41,57.7 35.47,57.64
PE13: length 12.3
  Top Layer w0.305: 38.01,57.64 38.01,56.73 37.72,56.44 28.07,56.44 27.84,56.67 U12.17
PE14: length 5.1
  Top Layer w0.635: 30.38,60.24 35.41,60.24 35.47,60.18
PE15: length 12.3
  Top Layer w0.305: 38.01,60.18 38.01,59.24 37.74,58.98 28.07,58.98 27.84,59.21 U12.15
SDIO_CLK_PC12: length 5.1
  Top Layer w0.635: 71.03,62.79 70.95,62.7 65.97,62.7
SDIO_CMD_PD2: length 12.3
  Top Layer w0.254: 73.57,57.71 73.57,56.73 73.28,56.44 63.63,56.44 63.43,56.64 63.43,57.62
SDIO_D0_PC8: length 5.1
  Top Layer w0.635: 65.97,32.22 70.95,32.22 71.03,32.31
SDIO_D1_PC9: length 12.3
  Top Layer w0.254: 73.57,67.87 73.57,66.85 73.33,66.6 63.63,66.6 63.43,66.8 63.43,67.78
SDIO_D2_PC10: length 5.1
  Top Layer w0.635: 71.03,65.33 70.95,65.24 65.97,65.24
SDIO_D3_PC11: length 12.3
  Top Layer w0.254: 73.57,62.79 73.57,61.81 73.28,61.52 63.68,61.52 63.43,61.77 63.43,62.7
USART1-RX_PA10: length 12.3
  Top Layer w0.254: 63.43,70.32 63.43,69.35 63.64,69.14 73.32,69.14 73.53,69.35 73.53,70.37 73.57,70.41
USART1-TX_PA9: length 5.1
  Top Layer w0.635: 71.03,67.87 70.95,67.78 65.97,67.78
USB_D+_PA12: length 12.3
  Top Layer w0.254: 73.57,72.95 73.53,72.91 73.53,71.88 73.33,71.68 63.66,71.68 63.43,71.92 63.43,72.86
USB_D-_PA11: length 5.1
  Top Layer w0.635: 71.03,72.95 70.95,72.86 65.97,72.86

## Copper pours and planes (outline as drawn; the poured copper is in the pictures)
+12V on Bottom Layer: 26.28,95.31 36.38,95.31 36.38,90.51 26.28,90.51
GND on Top Layer: -0.32,99.91 -0.31,99.96 -0.29,100 -0.25,100.03 -0.2,100.04 101.4,100.04 101.45,100.03 101.49,100 101.52,99.96 101.53,99.91 101.53,-0.17 101.52,-0.22 101.49,-0.26 101.45,-0.28 101.4,-0.29 -0.2,-0.29 -0.25,-0.28 -0.29,-0.26 -0.31,-0.22 -0.32,-0.17
GND on Top Layer: 26.42,79.73 39.15,79.73 39.15,76.55 26.42,76.55
GND on Top Layer: 59.55,95.92 73.67,95.92 73.67,89.9 59.55,89.9
GND on Bottom Layer: 0.59,99.83 0.6,99.88 0.63,99.92 0.67,99.95 0.72,99.96 102.32,99.96 102.37,99.95 102.41,99.92 102.44,99.88 102.44,99.83 102.44,-0.24 102.44,-0.29 102.41,-0.33 102.37,-0.36 102.32,-0.37 0.72,-0.37 0.67,-0.36 0.63,-0.33 0.6,-0.29 0.59,-0.24

Small or netless copper shapes (teardrops, artwork), in the pictures only: 272 on Top Layer, 98 on Bottom Layer

## Text on the board
Bottom Silkscreen Layer: +12V | +5V | 3.3V | GND
Top Silkscreen Layer: PC5 PB2 | PE15 PE14 | PA7 PB0 | PD8 PB12 | PB13 PE8 | PE7 PB10 | PE13 PE12 | PA3 PA5 | PC3 PA4 | PD13 PA1 | PC0 PD14 | PE10 PE11 | PD9 PB15 | PB1  PE9 | GND GND | PD11 PD10 | PB11 PB14 | PC2 PC1 | PA6 PC4 | PA2 PA0 | PB4 PB5 | 3.3V 3.3V | PC8 PC7 | +5V +5V | PB8 PB9 | PE5 PE3 | PC10 PA8 | PC6 PD15 | PA9 PC9 | PD12 PA10 | PE4 PB3 | PE0 PE1 | PE6 PE2 | PA11 PA12 | PC12 PC11 | PD1 PD0 | PD3 PD2 | PD5 PD4 | PB6 PB7 | PD7 PD6 | RST | GND | +12V | 3.3V | +5V | STM32最小系统
